# Altium project motordriver-v6.0.PrjPcb
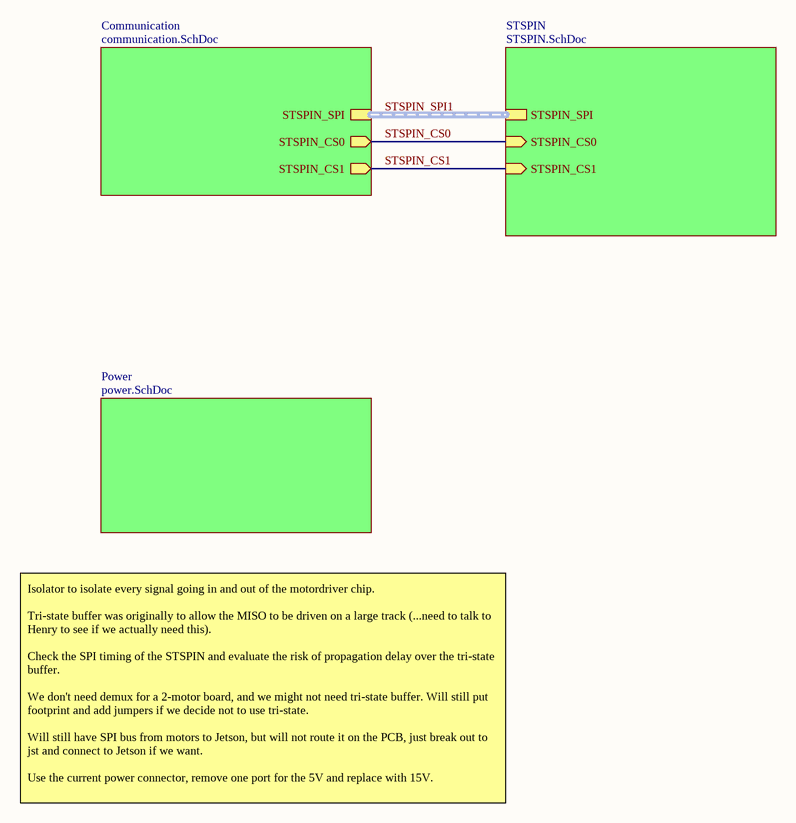
[diagram p0: root.SchDoc]
5 sheets, 16 parts. Net scope: hierarchical (ports join the sheet entries above them; power ports are global).
Sheets:
  root.SchDoc
    Communication = communication.SchDoc
    Power = power.SchDoc
    STSPIN = STSPIN.SchDoc
      Half-Bridge = half-bridge.SchDoc

## Sheet root.SchDoc
size A; SheetNumber: 1; SheetTotal: 5

### Sub-sheets
Communication = communication.SchDoc: STSPIN_CS1 (out), STSPIN_CS0 (out), STSPIN_SPI (harness STSPIN_SPI)
Power = power.SchDoc: no entries
STSPIN = STSPIN.SchDoc: STSPIN_CS0 (in), STSPIN_SPI (harness STSPIN_SPI), STSPIN_CS1 (in)

### Nets
STSPIN_CS0: sheet Communication/STSPIN_CS0, sheet STSPIN/STSPIN_CS0
STSPIN_CS1: sheet Communication/STSPIN_CS1, sheet STSPIN/STSPIN_CS1

### Buses and harness runs
harness STSPIN_SPI1 = sheet Communication/STSPIN_SPI = sheet STSPIN/STSPIN_SPI

### Notes on the sheet
- Isolator to isolate every signal going in and out of the motordriver chip.
  Tri-state buffer was originally to allow the MISO to be driven on a large track (...need to talk to Henry to see if we actually need this).
  Check the SPI timing of the STSPIN and evaluate the risk of propagation delay over the tri-state buffer.
  We don't need demux for a 2-motor board, and we might not need tri-state buffer. Will still put footprint and add jumpers if we decide not to use tri-state.
  Will still have SPI bus from motors to Jetson, but will not route it on the PCB, just break out to jst and connect to Jetson if we want.
  Use the current power connector, remove one port for the 5V and replace with 15V.

## Sheet communication.SchDoc
size 431 x 279 mm; SheetNumber: 2; SheetTotal: 5
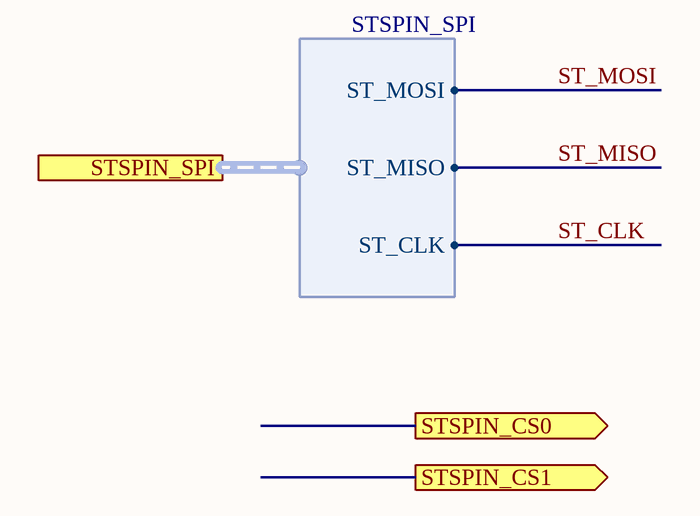
[diagram p1: communication.SchDoc]

### Ports
STSPIN_CS0 (out, see root[2B]), STSPIN_CS1 (out, see root[2B]), STSPIN_SPI (harness STSPIN_SPI, see root[2B], STSPIN[1B])

### Harnesses
STSPIN_SPI: ST_MOSI, ST_MISO, ST_CLK

### Notes on the sheet
- DWG. NO.
- REV.
- SHT.
- THIS DOCUMENT AND THE DATA DISCLOSED HEREIN OR HEREWITH IS THE PROPERTY OF ALTIUM LIMITED AND MAY BE FREELY DISTRIBUTED IN WHOLE. NO RIGHTS ARE RESERVED OR EXPRESS OR IMPLIED WARANTEE GIVEN.
- REVISION
- DESCRIPTION
- DATE
- APPROVED
- ENG:
- APPROVALS
- PROJECT
- DSN:
- CHK:
- REFERENCE DOCUMENTS
- PROJECT REVISION:
- TITLE
- DOCUMENT REVISION:
- DESIGN ITEM:
- BOM:
- FAB DWG:
- PCB DWG:
- ASSY DWG:
- SCALE:
- SIZE
- B
- CAGE CODE
- FILE NAME
- DWG NO.
- SHEET
- OF
- REV

## Sheet power.SchDoc
size 431 x 279 mm; SheetNumber: 5; SheetTotal: 5

### Notes on the sheet
- DWG. NO.
- REV.
- SHT.
- THIS DOCUMENT AND THE DATA DISCLOSED HEREIN OR HEREWITH IS THE PROPERTY OF ALTIUM LIMITED AND MAY BE FREELY DISTRIBUTED IN WHOLE. NO RIGHTS ARE RESERVED OR EXPRESS OR IMPLIED WARANTEE GIVEN.
- REVISION
- DESCRIPTION
- DATE
- APPROVED
- ENG:
- APPROVALS
- PROJECT
- DSN:
- CHK:
- REFERENCE DOCUMENTS
- PROJECT REVISION:
- TITLE
- DOCUMENT REVISION:
- DESIGN ITEM:
- BOM:
- FAB DWG:
- PCB DWG:
- ASSY DWG:
- SCALE:
- SIZE
- B
- CAGE CODE
- FILE NAME
- DWG NO.
- SHEET
- OF
- REV

## Sheet STSPIN.SchDoc
size 431 x 279 mm; SheetNumber: 3; SheetTotal: 5
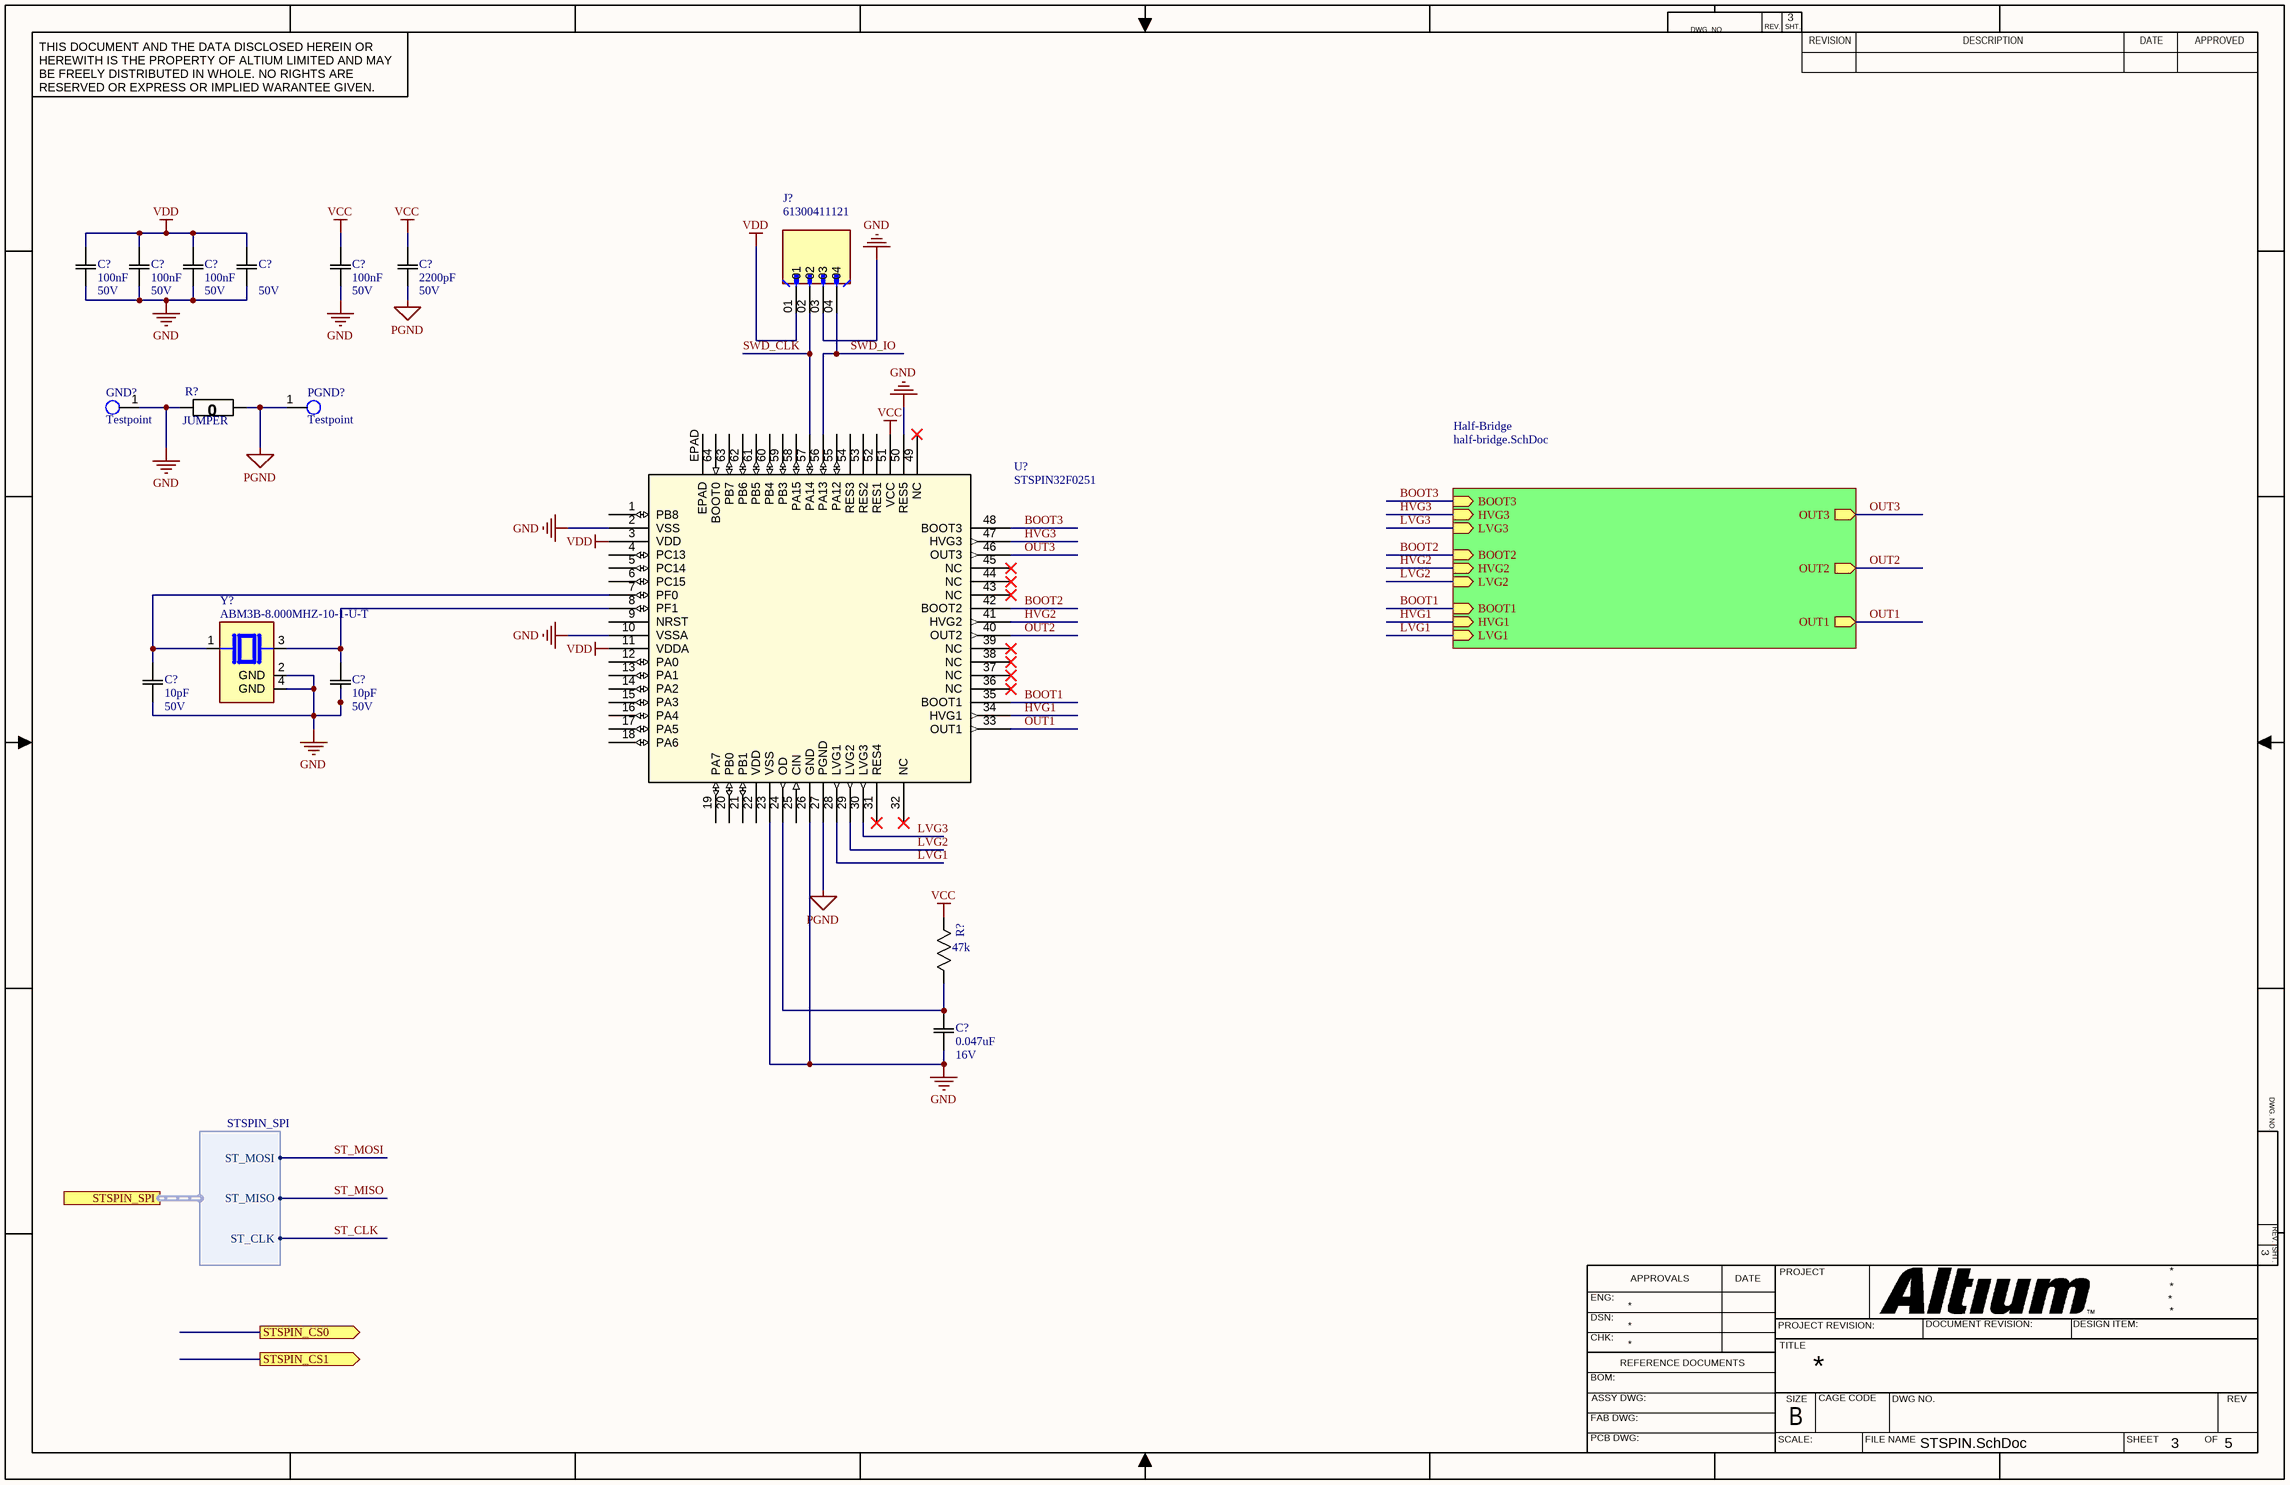
[diagram p2: STSPIN.SchDoc]

### Parts
(Parts that share a designator on the sheet are numbered #1, #2 ... from top to bottom, then left to right.)
C?#1  Rating: 50V  [0603]  (hidden comment: 100nF)
C?#2  Rating: 50V  [0603]  (hidden comment: 100nF)
C?#3  Rating: 50V  [0603]  (hidden comment: 100nF)
C?#4  Rating: 50V  [0603]
C?#5  Rating: 50V  [0603]  (hidden comment: 100nF)
C?#6  Rating: 50V  [0603]  (hidden comment: 2200pF)
C?#7  Rating: 50V  [0603]  (hidden comment: 10pF)
C?#8  Rating: 50V  [0603]  (hidden comment: 10pF)
C?#9  Rating: 16V  [0603]  (hidden comment: 0.047uF)
GND?  Testpoint  [TP_1mm]
J?  61300411121  [WURTH_61300411121]
PGND?  Testpoint  [TP_1mm]
R?#1  JUMPER  [1210]
R?#2  47k  [0603]
U?  STSPIN32F0251  [TQFP64_10X10_STM-M]
Y?  ABM3B-8.000MHZ-10-1-U-T  [XTAL_ABM3B-8.000MHZ-10-1-U-T]

### Sub-sheets
Half-Bridge = half-bridge.SchDoc: BOOT3 (in), HVG3 (in), LVG3 (in), OUT3 (out), BOOT2 (in), HVG2 (in), LVG2 (in), OUT2 (out), BOOT1 (in), HVG1 (in), LVG1 (in), OUT1 (out)

### Ports
STSPIN_CS0 (out, see root[2B]), STSPIN_CS1 (out, see root[2B]), STSPIN_SPI (harness STSPIN_SPI, see root[2B], STSPIN[1B])

### Harnesses
STSPIN_SPI: ST_MOSI, ST_MISO, ST_CLK

### Nets
GND: C?#1.1(C1) C?#2.1(C1) C?#3.1(C1) C?#4.1(C1) C?#5.1(C1) C?#7.1(C1) C?#8.1(C1) C?#9.1(C1) GND?.1(TP) J?.03 R?#1.2(R2) U?.2(VSS) U?.10(VSSA) U?.23(VSS) U?.26(GND) U?.50(RES5) Y?.2(GND) Y?.4(GND)
PGND: C?#6.1(C1) PGND?.1(TP) R?#1.1(R1) U?.27(PGND)
VCC: C?#5.2(C2) C?#6.2(C2) R?#2.2(R2) U?.51(VCC)
VDD: C?#1.2(C2) C?#2.2(C2) C?#3.2(C2) C?#4.2(C2) J?.01 U?.3(VDD) U?.11(VDDA)
BOOT1: U?.35(BOOT1) ; sheet Half-Bridge/BOOT1
BOOT2: U?.42(BOOT2) ; sheet Half-Bridge/BOOT2
BOOT3: U?.48(BOOT3) ; sheet Half-Bridge/BOOT3
HVG1: U?.34(HVG1) ; sheet Half-Bridge/HVG1
HVG2: U?.41(HVG2) ; sheet Half-Bridge/HVG2
HVG3: U?.47(HVG3) ; sheet Half-Bridge/HVG3
LVG1: U?.28(LVG1) ; sheet Half-Bridge/LVG1
LVG2: U?.29(LVG2) ; sheet Half-Bridge/LVG2
LVG3: U?.30(LVG3) ; sheet Half-Bridge/LVG3
OUT1: U?.33(OUT1) ; sheet Half-Bridge/OUT1
OUT2: U?.40(OUT2) ; sheet Half-Bridge/OUT2
OUT3: U?.46(OUT3) ; sheet Half-Bridge/OUT3
ST_CLK: port STSPIN_SPI.ST_CLK
ST_MISO: port STSPIN_SPI.ST_MISO
ST_MOSI: port STSPIN_SPI.ST_MOSI
SWD_CLK: J?.02 U?.57(PA14)
SWD_IO: J?.04 U?.56(PA13)
NetC?#7_2: C?#7.2(C2) U?.7(PF0) Y?.1
NetC?#8_2: C?#8.2(C2) U?.8(PF1) Y?.3
NetC?#9_2: C?#9.2(C2) R?#2.1(R1) U?.24(OD)

Not connected (* = marked no-connect by the designer): U? 1(PB8) 4(PC13) 5(PC14) 6(PC15) 9(NRST) 12(PA0) 13(PA1) 14(PA2) 15(PA3) 16(PA4) 17(PA5) 18(PA6) 19(PA7) 20(PB0) 21(PB1) 22(VDD) 25(CIN) 31(RES4)* 32(NC)* 36(NC)* 37(NC)* 38(NC)* 39(NC)* 43(NC)* 44(NC)* 45(NC)* 49(NC)* 52(RES1) 53(RES2) 54(RES3) 55(PA12) 58(PA15) 59(PB3) 60(PB4) 61(PB5) 62(PB6) 63(PB7) 64(BOOT0) EPAD

### Notes on the sheet
- DWG. NO.
- REV.
- SHT.
- THIS DOCUMENT AND THE DATA DISCLOSED HEREIN OR HEREWITH IS THE PROPERTY OF ALTIUM LIMITED AND MAY BE FREELY DISTRIBUTED IN WHOLE. NO RIGHTS ARE RESERVED OR EXPRESS OR IMPLIED WARANTEE GIVEN.
- REVISION
- DESCRIPTION
- DATE
- APPROVED
- ENG:
- APPROVALS
- PROJECT
- DSN:
- CHK:
- REFERENCE DOCUMENTS
- PROJECT REVISION:
- TITLE
- DOCUMENT REVISION:
- DESIGN ITEM:
- BOM:
- FAB DWG:
- PCB DWG:
- ASSY DWG:
- SCALE:
- SIZE
- B
- CAGE CODE
- FILE NAME
- DWG NO.
- SHEET
- OF
- REV

### Library data of the parts
C?#1-C?#5 = CAP 100nF 50V: Default Symbol for Capacitors; Manufacturer Part Number 1: CC0603KPX7R9BB104; Temperature Coefficient: X7R; Tolerance: 10%; Part Number: CAP 100nF 50V; Supplier 1: Digi-Key; Supplier Part Number 1: 311-3567-1-ND; Manufacturer Part Number 2: 0805J0500104KJT; Supplier 2: Digi-Key; Supplier Part Number 2: 1608-1458-1-ND
  C?#1-C?#3 C?#5: Value: 100nF
C?#6 = CAP 2200pF 50V: Default Symbol for Capacitors; Manufacturer Part Number 1: 06035C222KAT2A; Temperature Coefficient: X7R; Tolerance: 10%; Value: 2200pF; Part Number: CAP 2200pF 50V; Supplier 1: Digi-Key; Supplier Part Number 1: 478-1219-1-ND; Manufacturer Part Number 2: CL21B222KBANNNC; Supplier 2: Digi-Key; Supplier Part Number 2: 1276-1171-1-ND
C?#7 C?#8 = CAP 10pF 50V: Default Symbol for Capacitors; Temperature Coefficient: X7R; Tolerance: 10%; Value: 10pF; Part Number: CAP 10pF 50V
C?#9 = CAP 0.047uF 16V: Default Symbol for Capacitors; Temperature Coefficient: X5R; Tolerance: 10%; Value: 0.047uF; Part Number: CAP 0.047uF 16V
GND? PGND? = TP_1MM: Part Number: TP_1MM
J? = 61300411121: Connector Header Through Hole 4 position 0.100 (2.54mm); MF: Wurth Electronics; SnapEDA_Link: https://www.snapeda.com/parts/61300411121/Wurth+Electronics+Inc./view-part/?ref=snap; Package: None; Value: *; MP: 61300411121; Check_prices: https://www.snapeda.com/parts/61300411121/Wurth+Electronics+Inc./view-part/?ref=eda
R?#1 = RES 0 JUMPER: RES SMD 0 OHM JUMPER GENERIC 0603; Value: 0; Package: 0805; Part Number: RES 0 JUMPER; Tolerance: N/A
R?#2 = RES 47k 1/8W - 1%: Default Resistor Symbol; Manufacturer Part Number 1: MCT06030C4702FP500; Power (Watts): 0.125W; Tolerance: 1%; Package: 0805; Value: 47k; Part Number: RES 47k 1/8W - 1%; Supplier 1: Digi-Key; Supplier Part Number 1: MCT0603-47.0K-CFCT-ND; Supplier URL 1: https://www.digikey.ca/en/products/detail/vishay-beyschlag-draloric-bc-components/MCT06030C4702FP500/2607854?s=N4IgTCBcDaILIGEAqAGAbCgzAWgCwHYA6FAaWwQDFlsA5AERAF0BfIA
U? = STSPIN32F0251: No Description Available; Mfr_Name: STMicroelectronics; RefDes: RefDes; Type: Type
Y? = ABM3B-8.000MHZ-10-1-U-T: 8 MHz Â±10ppm Crystal 10pF 200 Ohms 4-SMD, No Lead; MF: Abracon; Value: *; Package: SMD-4 Abracon LLC; SnapEDA_Link: https://www.snapeda.com/parts/ABM3B-8.000MHZ-10-1-U-T/Abracon+LLC/view-part/?ref=snap; MP: ABM3B-8.000MHZ-10-1-U-T; Purchase-URL: https://pricing.snapeda.com/search/part/ABM3B-8.000MHZ-10-1-U-T/?ref=eda; Availability: In Stock; Price: None; Check_prices: https://www.snapeda.com/parts/ABM3B-8.000MHZ-10-1-U-T/Abracon+LLC/view-part/?ref=eda

## Sheet half-bridge.SchDoc
size 431 x 279 mm; SheetNumber: 4; SheetTotal: 5
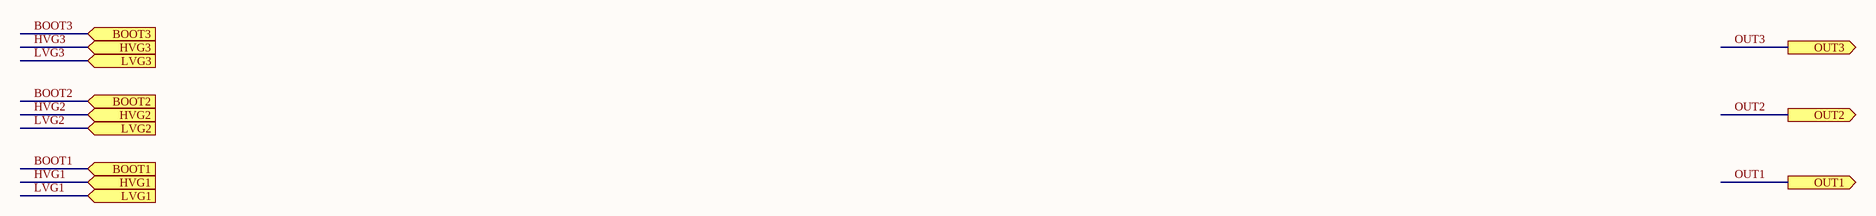
[diagram p3: half-bridge.SchDoc]

### Ports
BOOT1 (in), BOOT2 (in), BOOT3 (in), HVG1 (in), HVG2 (in), HVG3 (in), LVG1 (in), LVG2 (in), LVG3 (in), OUT1 (out), OUT2 (out), OUT3 (out)

### Notes on the sheet
- DWG. NO.
- REV.
- SHT.
- THIS DOCUMENT AND THE DATA DISCLOSED HEREIN OR HEREWITH IS THE PROPERTY OF ALTIUM LIMITED AND MAY BE FREELY DISTRIBUTED IN WHOLE. NO RIGHTS ARE RESERVED OR EXPRESS OR IMPLIED WARANTEE GIVEN.
- REVISION
- DESCRIPTION
- DATE
- APPROVED
- ENG:
- APPROVALS
- PROJECT
- DSN:
- CHK:
- REFERENCE DOCUMENTS
- PROJECT REVISION:
- TITLE
- DOCUMENT REVISION:
- DESIGN ITEM:
- BOM:
- FAB DWG:
- PCB DWG:
- ASSY DWG:
- SCALE:
- SIZE
- B
- CAGE CODE
- FILE NAME
- DWG NO.
- SHEET
- OF
- REV